# Altium schematic sheet Flash.SchDoc
size A4
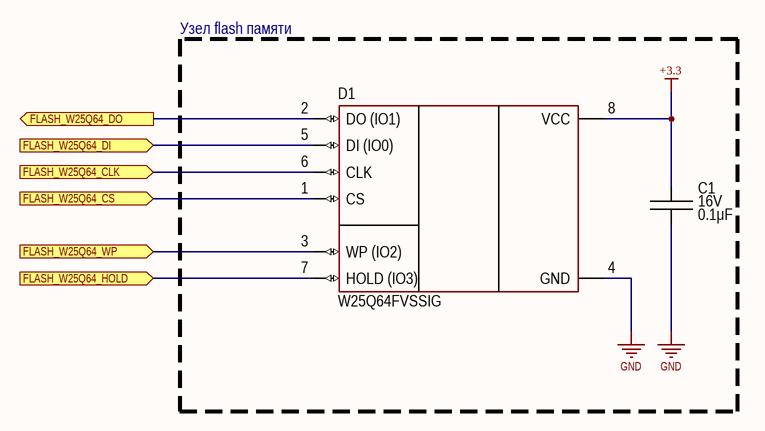
[diagram p0: Flash.SchDoc]

## Parts
C1  value 0.1μF  Voltage: 16V  [CAP: 0603]
D1  (no value)  [8-SOIC]

## Blocks framed on the sheet
Узел flash памяти: C1 D1

## Ports
FLASH_W25Q64_CLK (in), FLASH_W25Q64_CS (in), FLASH_W25Q64_DI (in), FLASH_W25Q64_DO (out), FLASH_W25Q64_HOLD (in), FLASH_W25Q64_WP (in)

## Nets
+3.3: C1.1 D1.8(VCC)
GND: C1.2 D1.4(GND)
FLASH_W25Q64_CLK: D1.6(CLK) ; port FLASH_W25Q64_CLK
FLASH_W25Q64_CS: D1.1(CS) ; port FLASH_W25Q64_CS
FLASH_W25Q64_DI: D1.5(DI_(IO0)) ; port FLASH_W25Q64_DI
FLASH_W25Q64_DO: D1.2(DO_(IO1)) ; port FLASH_W25Q64_DO
FLASH_W25Q64_HOLD: D1.7(HOLD_(IO3)) ; port FLASH_W25Q64_HOLD
FLASH_W25Q64_WP: D1.3(WP_(IO2)) ; port FLASH_W25Q64_WP

## Library data of the parts
C1 = Ceramic_0603: Manufacturer: Yageo; PartNumber: CC0603KRX7R7BB104; ValueManufacturerPartNumber: Ceramic capacitor, 0.1μF, X7R, ±10%, 16V, 0603, -55...+125°C; TypeCapacitor: Ceramic capacitor; Tolerance: ±10%; TypeDielectric: X7R; Package: 0603; HelpURL: https://www.digikey.com/product-detail/en/yageo/CC0603KRX7R7BB104/311-1088-1-ND/302998; Temperature: -55...+125°C
D1 = W25Q64FVSSIG: FLASH; Manufacturer: Winbond Electronics; ValueManufacturerPartNumber: IC memory, FLASH, 64Mb (8M x 8), 104 MHz, SPI/QuadSPI, 2.7...3.6V, -40...+85°C, 8-SOIC; Supply: 2.7...3.6V; Speed: 104 MHz; InterfaceData: SPI/QuadSPI; MemorySize: 64Mb (8M x 8); HelpURL: https://www.chipdip.by/product/w25q64fvssig-25q64fvsig; Package: 8-SOIC; ComponentType: IC memory; Temperature: -40...+85°C; MemoryType: FLASH; PartNumber: W25Q64FVSSIG